# Altium schematic sheet ActuatorMKII_Torpedoes.SchDoc: ActuatorMKII_Torpedoes
size B; Date: 09/17/2022; Author: Dylan Trainor; CompanyName: UWRT; Organization: Ohio State University; Address1: ADDRESS 1; Address2: ADDRESS 2; Address3: ADDRESS 3; Address4: ADDRESS 4; Revision: -; SheetNumber: 3; SheetTotal: 6; ENG_APP_DATE: --/--/--; DSN_APP_DATE: --/--/--; CHK_APP_DATE: --/--/--
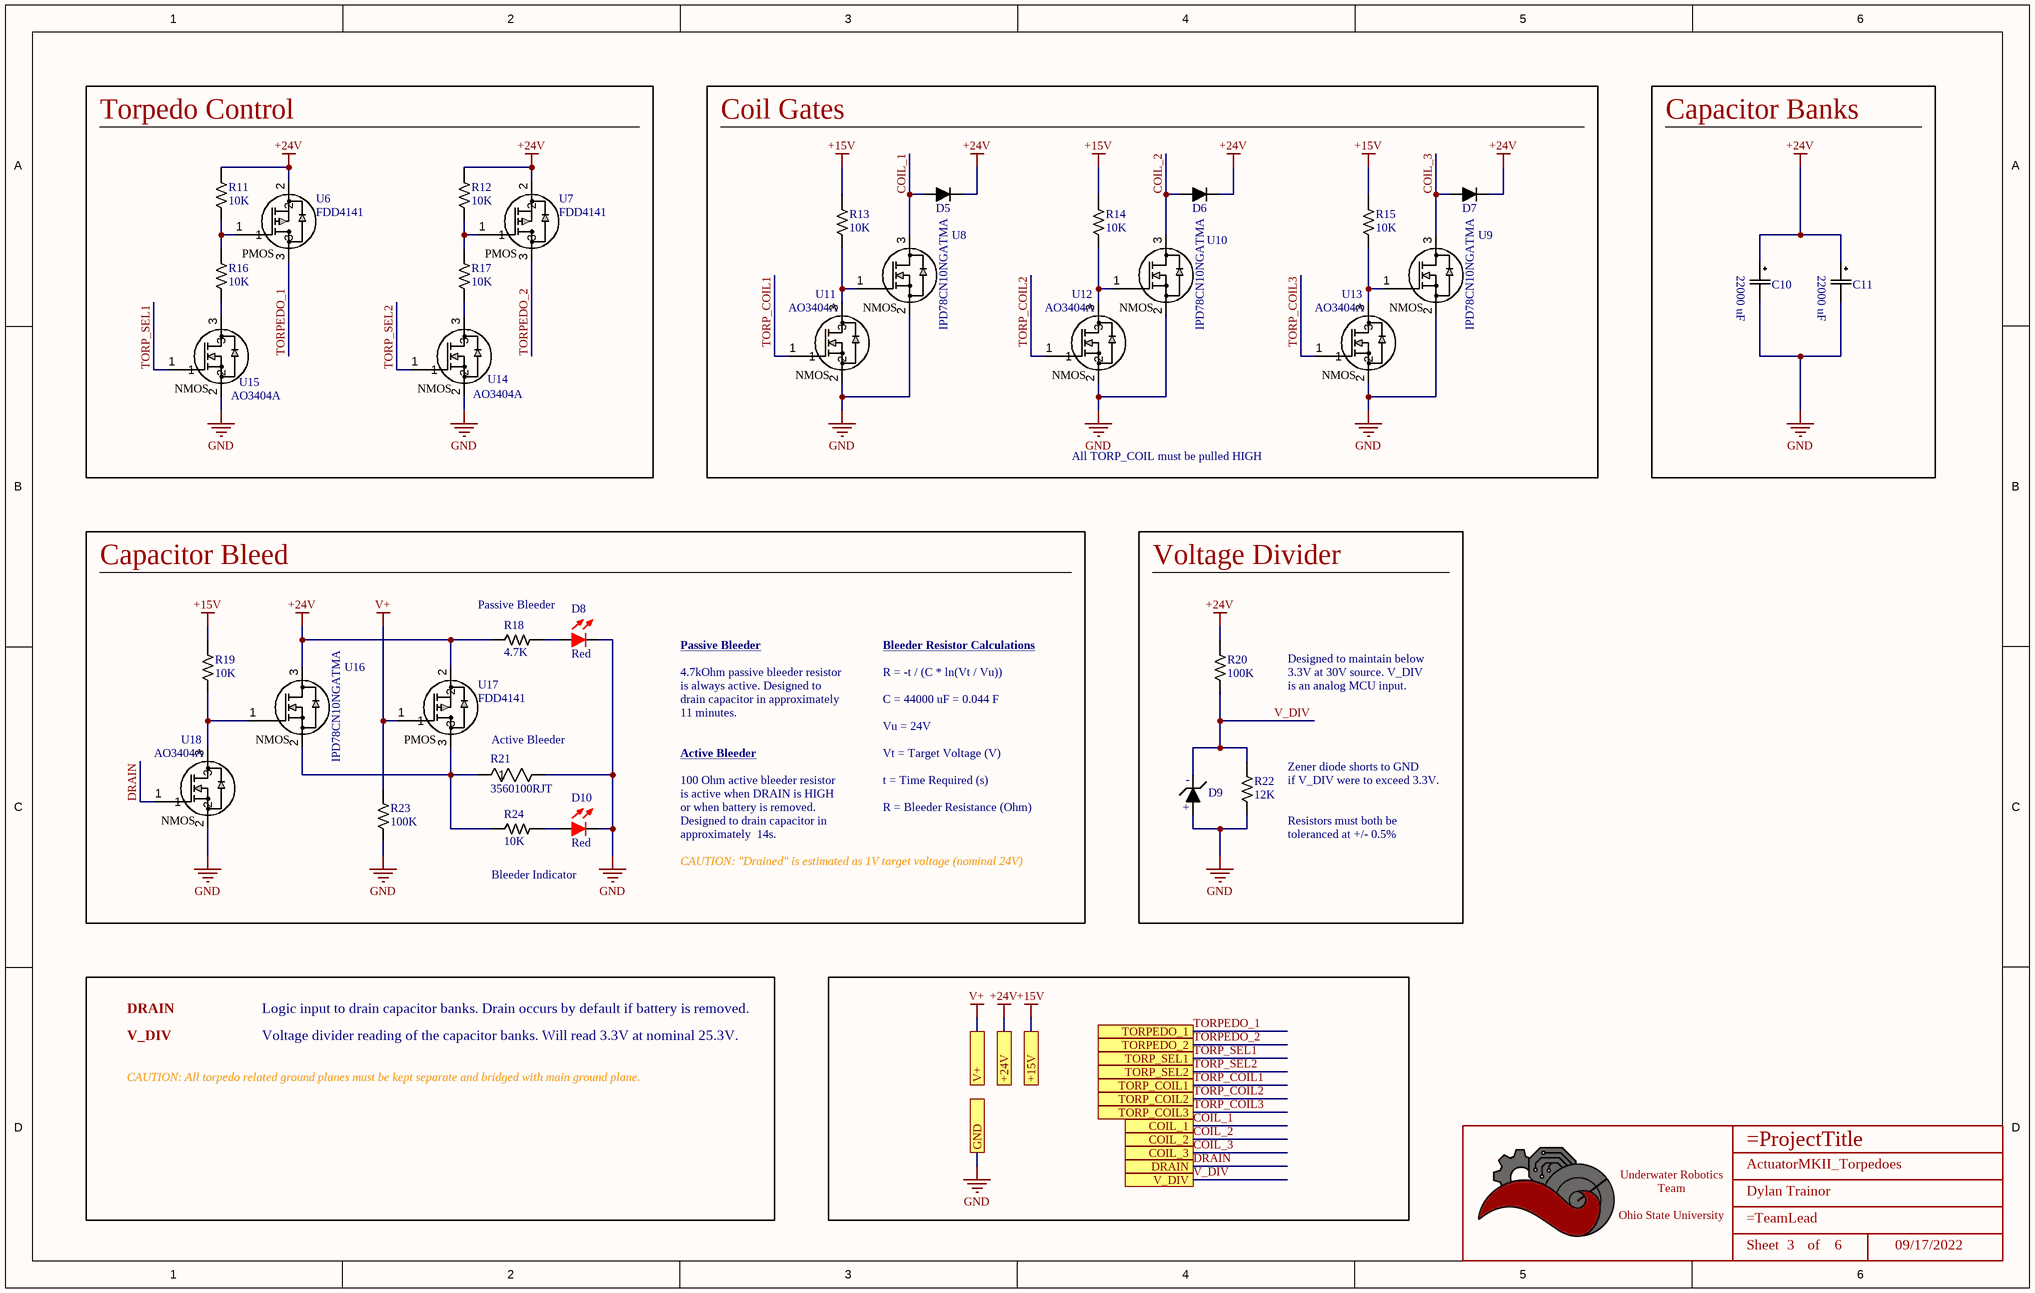
[diagram p0: ActuatorMKII_Torpedoes.SchDoc]

## Parts
*  Title_Block  [LOGO]  (value not drawn)  (graphical)
C10  Cap 22000uF 22V +/-20% Aluminum  [UVK1E223MRD_RA]  (value not drawn)
C11  Cap 22000uF 22V +/-20% Aluminum  [UVK1E223MRD_RA]  (value not drawn)
D5  B330-13-F  [DO-214AB]  (value not drawn)
D6  B330-13-F  [DO-214AB]  (value not drawn)
D7  B330-13-F  [DO-214AB]  (value not drawn)
D8  Color: Red  [LED_0603]  (hidden comment: 150060RS75000)
D9  Zener_Diode_3.3V_250mW_1  [SOD-123]  (value not drawn)
D10  Color: Red  [LED_0603]  (hidden comment: 150060RS75000)
R11  Value  (Ohms): 10K  [RESISTOR_0603]  (hidden comment: 10k Ohm 5% 1/10W)
R12  Value  (Ohms): 10K  [RESISTOR_0603]  (hidden comment: 10k Ohm 5% 1/10W)
R13  Value  (Ohms): 10K  [RESISTOR_0603]  (hidden comment: 10k Ohm 5% 1/10W)
R14  Value  (Ohms): 10K  [RESISTOR_0603]  (hidden comment: 10k Ohm 5% 1/10W)
R15  Value  (Ohms): 10K  [RESISTOR_0603]  (hidden comment: 10k Ohm 5% 1/10W)
R16  Value  (Ohms): 10K  [RESISTOR_0603]  (hidden comment: 10k Ohm 5% 1/10W)
R17  Value  (Ohms): 10K  [RESISTOR_0603]  (hidden comment: 10k Ohm 5% 1/10W)
R18  Value  (Ohms): 4.7K  [RESISTOR_0603]  (hidden comment: 4.7k Ohm 5% 1/10W)
R19  Value  (Ohms): 10K  [RESISTOR_0603]  (hidden comment: 10k Ohm 5% 1/10W)
R20  Value  (Ohms): 100K  [RESISTOR_0603]  (hidden comment: 100k Ohm 0.5% 1/10W)
R21  3560100RJT  [RES_3550_TEC]
R22  Value  (Ohms): 12K  [RESISTOR_0603]  (hidden comment: 12k Ohm 0.5% 1/10W)
R23  Value  (Ohms): 100K  [RESISTOR_0603]  (hidden comment: 100k Ohm 5% 1/8W)
R24  Value  (Ohms): 10K  [RESISTOR_0603]  (hidden comment: 10k Ohm 5% 1/10W)
U6  FDD4141  [DPAK_ONS]
U7  FDD4141  [DPAK_ONS]
U8  MOSFET N-Ch 100V 13A TO252-3  [DPAK_ONS]  (value not drawn)
U9  MOSFET N-Ch 100V 13A TO252-3  [DPAK_ONS]  (value not drawn)
U10  MOSFET N-Ch 100V 13A TO252-3  [DPAK_ONS]  (value not drawn)
U11  AO3404A  [SOT-23-3]
U12  AO3404A  [SOT-23-3]
U13  AO3404A  [SOT-23-3]
U14  AO3404A  [SOT-23-3]
U15  AO3404A  [SOT-23-3]
U16  MOSFET N-Ch 100V 13A TO252-3  [DPAK_ONS]  (value not drawn)
U17  FDD4141  [DPAK_ONS]
U18  AO3404A  [SOT-23-3]

## Blocks framed on the sheet
Torpedo Control: R11 R12 R16 R17 U6 U7 U14 U15
Coil Gates: D5-D7 R13-R15 U8-U13
Capacitor Bleed: D8 D10 R18 R19 R21 R23 R24 U16-U18
Voltage Divider: D9 R20 R22

## Ports
+15V, +24V, COIL_1, COIL_2, COIL_3, DRAIN, GND, TORP_COIL1, TORP_COIL2, TORP_COIL3, TORP_SEL1, TORP_SEL2, TORPEDO_1, TORPEDO_2, V+, V_DIV

## Nets
+15V: R13.1 R14.1 R15.1 R19.1 ; port +15V
+24V: C10.1 C11.1 D5.2 D6.2 D7.2 R11.1 R12.1 R18.2 R20.1 U6.2 U7.2 U16.3 U17.2 ; port +24V
GND: C10.2 C11.2 D8.2 D9.1 D10.2 R21.2 R22.2 R23.2 U8.2 U9.2 U10.2 U11.2 U12.2 U13.2 U14.2 U15.2 U18.2 ; port GND
V+: R23.1 U17.1 ; port V+
COIL_1: D5.1 U8.3 ; port COIL_1
COIL_2: D6.1 U10.3 ; port COIL_2
COIL_3: D7.1 U9.3 ; port COIL_3
DRAIN: U18.1 ; port DRAIN
TORP_COIL1: U11.1 ; port TORP_COIL1
TORP_COIL2: U12.1 ; port TORP_COIL2
TORP_COIL3: U13.1 ; port TORP_COIL3
TORP_SEL1: U15.1 ; port TORP_SEL1
TORP_SEL2: U14.1 ; port TORP_SEL2
TORPEDO_1: U6.3 ; port TORPEDO_1
TORPEDO_2: U7.3 ; port TORPEDO_2
V_DIV: D9.2 R20.2 R22.1 ; port V_DIV
NetD8_1: D8.1 R18.1
NetD10_1: D10.1 R24.1
NetR11_2: R11.2 R16.1 U6.1
NetR12_2: R12.2 R17.1 U7.1
NetR13_2: R13.2 U8.1 U11.3
NetR14_2: R14.2 U10.1 U12.3
NetR15_2: R15.2 U9.1 U13.3
NetR16_2: R16.2 U15.3
NetR17_2: R17.2 U14.3
NetR19_2: R19.2 U16.1 U18.3
NetR21_1: R21.1 R24.2 U16.2 U17.3

## Notes on the sheet
- Capacitor Banks
- All TORP_COIL must be pulled HIGH
- Passive Bleeder
- 4.7kOhm passive bleeder resistor
- is always active. Designed to
- drain capacitor in approximately
- R = -t / (C * ln(Vt / Vu))
- C = 44000 uF = 0.044 F
- Bleeder Resistor Calculations
- Designed to maintain below
- 3.3V at 30V source. V_DIV
- is an analog MCU input.
- Active Bleeder
- 11 minutes.
- Vu = 24V
- Vt = Target Voltage (V)
- (near R22) Zener diode shorts to GND
- 100 Ohm active bleeder resistor
- is active when DRAIN is HIGH
- Designed to drain capacitor in
- approximately  14s.
- or when battery is removed.
- t = Time Required (s)
- R = Bleeder Resistance (Ohm)
- (near R22) if V_DIV were to exceed 3.3V.
- (near R22) Resistors must both be
- (near R22) toleranced at +/- 0.5%
- Bleeder Indicator
- CAUTION: "Drained" is estimated as 1V target voltage (nominal 24V)
- DRAIN
- V_DIV
- Logic input to drain capacitor banks. Drain occurs by default if battery is removed.
- Voltage divider reading of the capacitor banks. Will read 3.3V at nominal 25.3V.
- CAUTION: All torpedo related ground planes must be kept separate and bridged with main ground plane.
- DWG. NO.
- REV.
- SHT.
- THIS DOCUMENT AND THE DATA DISCLOSED HEREIN OR HEREWITH IS THE PROPERTY OF ALTIUM LIMITED AND MAY BE FREELY DISTRIBUTED IN WHOLE. NO RIGHTS ARE RESERVED OR EXPRESS OR IMPLIED WARANTEE GIVEN.
- REVISION
- DESCRIPTION
- DATE
- APPROVED
- ENG:
- APPROVALS
- PROJECT
- DSN:
- CHK:
- REFERENCE DOCUMENTS
- PROJECT REVISION:
- TITLE
- DOCUMENT REVISION:
- DESIGN ITEM:
- BOM:
- FAB DWG:
- PCB DWG:
- ASSY DWG:
- SCALE:
- SIZE
- B
- CAGE CODE
- FILE NAME
- DWG NO.
- SHEET
- OF
- REV
- (in symbol AO3404A) NMOS
- (in symbol CAPACITOR_22000uF_Radial) 22000 uF
- (in symbol FDD4141) PMOS
- (in symbol IPD78CN10NGATMA1) NMOS; IPD78CN10NGATMA
- (in symbol Title_Block) Underwater Robotics Team / Ohio State University; Sheet; of
- (in symbol Zener_Diode_3.3V_250mW_1) -; +

## Library data of the parts
* = Title_Block: UWRT Schematic Title Block Template / Created June 2021, Dylan Trainor
C10 C11 = CAPACITOR_22000uF_Radial: Cap 22000uF 25V 20% Aluminum Radial Through Hole; Voltage Range: 6.3-450V; Made By: Cole Davis; Verified By: Name; Value: 22000uF; Supplier 1: Digi-Key; Supplier Part Number 1: 493-12405-ND
D5-D7 = SCHOTTKY_30V_3A: Schottky Diode, 30V reverse breakdown, 3A, Vf = 0.500V; Made By: Tyson N.; Forward Voltage: 500mV; ComponentLink1Description: Datasheet; ComponentLink1URL: https://www.onsemi.com/pdf/datasheet/mbr0520lt1-d.pdf; Forward Current: 3A; Package: DO-214AB; Supplier 1: RSComponents; Supplier Part Number 1: 7513269
D8 D10 = LED_Red_0603: LED Red Vf= 2V If = 0.020A / 150060RS75000; Made By: Robert Pafford; Forward Current: 20mA; Forward Voltage: 2V; Package: 0603; Supplier 1: Digi-Key; Supplier Part Number 1: 732-4978-1-ND
D9 = Zener_Diode_3.3V_250mW_1: Zener Diode | 3.3 V | 250 mW | SOT-23; Made By: Nathan A; Voltage - Zener: 10V; Power: 410mW; Package: SOD-123; ComponentLink1Description: Datasheet; ComponentLink1URL: https://www.panjit.com.tw/upload/datasheet/BZT52-C2V4_SERIES.pdf; Supplier 1: Newark; Supplier Part Number 1: 50AC7315
R11-R17 R19 R24 = RESISTOR_10K_0603: RES 10k OHM 5% 1/10W 0603; Tolerance: +/- 5%; Wattage: 1/8W; Made By: Robert Pafford; ComponentLink1Description: Datasheet; ComponentLink1URL: https://www.bourns.com/docs/product-datasheets/CRxxxxx.pdf; Supplier: Digikey; Digikey Part Numer: CR0603-JW-104ELFTR-ND; Supplier 1: Digi-Key; Supplier Part Number 1: 2019-RK73B1JTTD103JCT-ND
R18 = RESISTOR_4.7K_0603: RES 4.7k OHM 5% 1/10W 0603; Tolerance: +/- 5%; Made By: Robert Pafford; Wattage: 1/10W; Supplier: Digikey; Digikey Part Numer: CR0603-JW-104ELFTR-ND; Supplier 1: Digi-Key; Supplier Part Number 1: RMCF0603JT4K70CT-ND
R20 = RESISTOR_100K_0.5%_0603: RES 100k OHM 0.5% 1/10W 0603; Tolerance: +/- 0.5%; Made By: John Ulm; ComponentLink1Description: Datasheet; ComponentLink1URL: https://www.bourns.com/docs/product-datasheets/CRxxxxx.pdf; Wattage: 1/10W; Supplier: Digikey; Digikey Part Numer: CR0603-JW-104ELFTR-ND; Supplier 1: Digi-Key; Supplier Part Number 1: 311-2395-1-ND
R21 = 3560100RJT: RES 35601 100R 6W 5%; Mfr_Name: TE Connectivity; Manufacturer_Part_Number: 3550120RJT; Copyright: Copyright (C) 2022 Ultra Librarian. All rights reserved.; RefDes: RefDes; Type: DEV; Supplier 1: Newark; Supplier Part Number 1: 34AH4272
R22 = RESISTOR_12K_0.5%_0603: RES 12k OHM 0.5% 1/10W 0603; Tolerance: +/- 0.5%; Wattage: 1/8W; Made By: John Ulm; ComponentLink1Description: Datasheet; ComponentLink1URL: https://www.bourns.com/docs/product-datasheets/CRxxxxx.pdf; Supplier: Digikey; Digikey Part Numer: CR0603-JW-104ELFTR-ND; Supplier 1: Digi-Key; Supplier Part Number 1: 311-2415-1-ND
R23 = RESISTOR_100K_0603_1: RES 100k OHM 5% 1/10W 0603; Tolerance: +/- 5%; Made By: Flip B; ComponentLink1Description: Datasheet; ComponentLink1URL: https://www.bourns.com/docs/product-datasheets/CRxxxxx.pdf; Wattage: 1/10W; Supplier: Digikey; Digikey Part Numer: CR0603-JW-104ELFTR-ND; Supplier 1: Digi-Key; Supplier Part Number 1: CR0603-JW-104ELFCT-ND
U6 U7 U17 = FDD4141: P-Channel 10.8A (Ta), 50A (Tc) 2.4W (Ta), 69W (Tc) Surface Mount D-PAK (TO-252AA); FET Type: P-Channel, Power; Vendor: ON Semiconductor; SourceLibrary: ON_Semiconductor_2020-01-13; Vgs (Max): ±20V; Vgs (th): 3V @ 250µA; Vdss: 40 V; Rds (on): 12.3mOhm @ 12.7A, 10V; Amp Rating: 10.8 A; Package: D-PAK (TO-252AA); Manufacturer_Part_Number: FDD4141; Power Dissipation: 2.4W (Ta), 69W (Tc); Supplier 1: Digi-Key; Supplier Part Number 1: FDD4141CT-ND; Created By: Dylan T
U8-U10 U16 = IPD78CN10NGATMA1: N-Channel 100 V 13A (Tc) 31W (Tc) Surface Mount PG-TO252-3; Vg(th): 2V<4V; Created By: John Ulm; Verified By: ----; Supplier 1: Digi-Key; VDS: 100V; Continuous drain current: 13A; Supplier Part Number 1: IPD78CN10NGATMA1CT-ND
U11-U15 U18 = AO3404A: N-Channel 30 V 5.8A (Ta) 1.4W (Ta) Surface Mount SOT-23-3; Vendor: Alpha & Omega Semiconductor Inc.; SourceLibrary: ON_Semiconductor_2020-01-13; Vgs (Max): 3V @ 5.8A, 10V; Vgs (th): 3V @ 250µA; Vdss: 30V; Rds (on): 28mOhm @ 5.8A, 10V; Amp Rating: 5.8 A; FET Type: N-Channel; Package: SOT23-3L; Manufacturer _Part_Number: AO3404A; Power Dissipation: 1.4W (Ta); Supplier 1: Digi-Key; Supplier Part Number 1: 785-1004-1-ND; Created By: Dylan T